# EAGLE schematic mdbt40 (EAGLE 6.6.0)
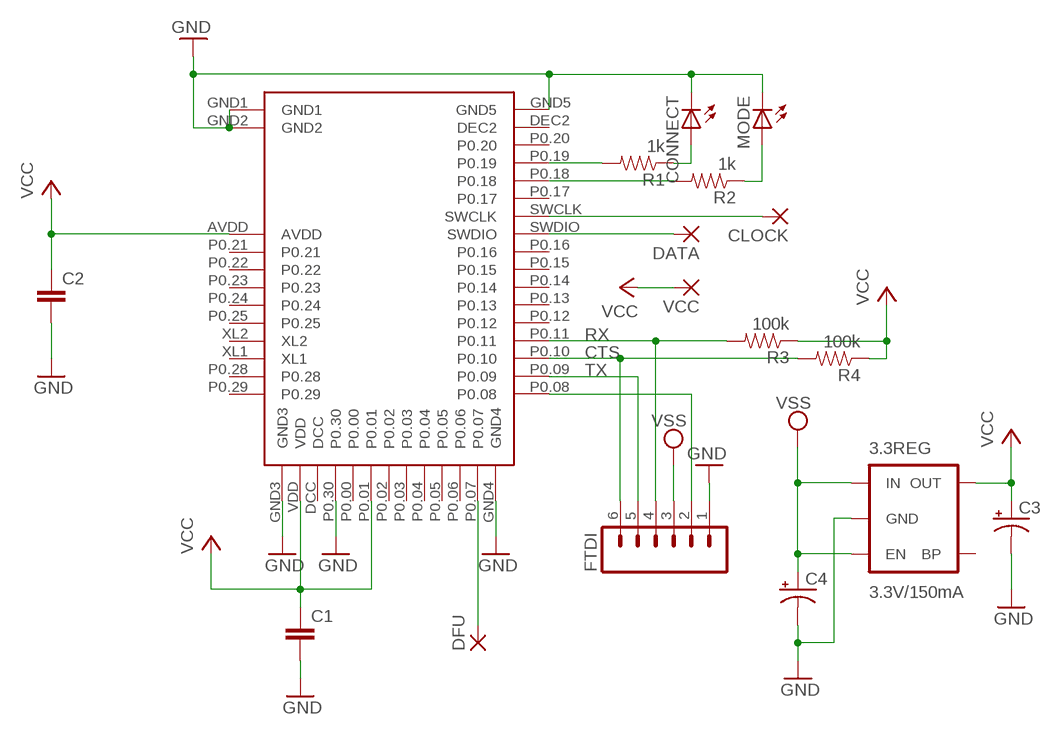
[diagram p0: schematic, sheet 1]

## Parts
3.3REG  3.3V/150mA  V_REG_MIC52053.3V  [SOT23-5]
C1  CAP0603-CAP  [0603-CAP]
C2  CAP0603-CAP  [0603-CAP]
C3  CAP_POL1206  [EIA3216]
C4  CAP_POL1206  [EIA3216]
CLOCK  SMD2  [SMD1,27-2,54]
CONNECT  LEDCHIPLED_0603  [CHIPLED_0603]
DATA  SMD2  [SMD1,27-2,54]
DFU  SMD2  [SMD1,27-2,54]
FTDI  M06LONGPADS  [1X06_LONGPADS]
MODE  LEDCHIPLED_0603  [CHIPLED_0603]
R1  1k  RESISTOR0603  [0603-RES]
R2  1k  RESISTOR0603  [0603-RES]
R3  100k  RESISTOR0603  [0603-RES]
R4  100k  RESISTOR0603  [0603-RES]
U$1  MDBT40  [MDBT40]
VCC  SMD2  [SMD1,27-2,54]

## Nets
CTS: FTDI.6 R4.2 U$1.P0.10
GND: 3.3REG.2(GND) C1.2 C2.2 C3.C(-) C4.C(-) CONNECT.C FTDI.1 MODE.C U$1.GND1 U$1.GND2 U$1.GND3 U$1.GND4 U$1.GND5 U$1.P0.30
N$1: R1.2 U$1.P0.19
N$2: R2.2 U$1.P0.18
N$3: CONNECT.A R1.1
N$4: MODE.A R2.1
N$5: CLOCK.1(P) U$1.SWCLK
N$6: DATA.1(P) U$1.SWDIO
N$7: DFU.1(P) U$1.P0.07
N$8: FTDI.2 U$1.P0.08
RX: FTDI.4 R3.2 U$1.P0.11
TX: FTDI.5 U$1.P0.09
VCC: 3.3REG.5(OUT) C1.1 C2.1 C3.A(+) R3.1 R4.1 U$1.AVDD U$1.P0.01 U$1.VDD VCC.1(P)
VSS: 3.3REG.1(IN) 3.3REG.3(EN) C4.A(+) FTDI.3
Unconnected: 3.3REG.4(BP) U$1.DCC U$1.DEC2 U$1.P0.00 U$1.P0.02 U$1.P0.03 U$1.P0.04 U$1.P0.05 U$1.P0.06 U$1.P0.12 U$1.P0.13 U$1.P0.14 U$1.P0.15 U$1.P0.16 U$1.P0.17 U$1.P0.20 U$1.P0.21 U$1.P0.22 U$1.P0.23 U$1.P0.24 U$1.P0.25 U$1.P0.28 U$1.P0.29 U$1.XL1 U$1.XL2

## Library data of the parts
3.3REG = SparkFun-PowerIC:V_REG_MIC5205: V_REG MIC5219 Standard 3.3V and 5V 150mA LDO voltage regulator in SOT-23 layout. Micrel part MIC5205. BP (by-pass) pin is used to lower output noise with 470pF cap, may be left open.; PROD_ID: VREG-00822
C1 C2 = SparkFun-Passives:CAP: Capacitor Standard 0603 ceramic capacitor, and 0.1" leaded capacitor.
C3 C4 = SparkFun-Capacitors:CAP_POL: Capacitor Polarized These are standard SMD and PTH capacitors. Normally 10uF, 47uF, and 100uF in electrolytic and tantalum varieties. Always verify the external diameter of the through hole cap, it varies with capacity, voltage, and manufacturer. The EIA devices should be standard.
CLOCK DATA DFU VCC = wirepad:SMD2: SMD PAD
CONNECT MODE = adafruit:LED: LED OSRAM: - CHIPLED LG R971, LG N971, LY N971, LG Q971, LY Q971, LO R971, LY R971 LH N974, LH R974 LS Q976, LO Q976, LY Q976 LO Q996 - Hyper CHIPLED LW Q18S LB Q993, LB Q99A, LB R99A - SideLED LS A670, LO A670, LY A670, LG A670, LP A670 LB A673, LV A673, LT A673, LW A673 LH A674 LY A675 LS A676, LA A676, LO A676, LY A676, LW A676 LS A679, LY A679, LG A679 - Hyper Micro SIDELED® LS Y876, LA Y876, LO Y876, LY Y876 LT Y87S - SmartLED LW L88C, LW L88S LB L89C, LB L89S, LG L890 LS L89K, LO L89K, LY L89K LS L896, LA L896, LO L896, LY L896 - TOPLED LS T670, LO T670, LY T670, LG T670, LP T670 LSG T670, LSP T670, LSY T670, LOP T670, LYG T670 LG T671, LOG T671, LSG T671 LB T673, LV T673, LT T673, LW T673 LH T674 LS T676, LA T676, LO T676, LY T676, LB T676, LH T676, LSB T676, LW T676 LB T67C, LV T67C, LT T67C, LS T67K, LO T67K, LY T67K, LW E67C LS E67B, LA E67B, LO E67B, LY E67B, LB E67C, LV E67C, LT E67C LW T67C LS T679, LY T679, LG T679 LS T770, LO T770, LY T770, LG T770, LP T770 LB T773, LV T773, LT T773, LW T773 LH T774 LS E675, LA E675, LY E675, LS T675 LS T776, LA T776, LO T776, LY T776, LB T776 LHGB T686 LT T68C, LB T68C - Hyper Mini TOPLED® LB M676 - Mini TOPLED Santana® LG M470 LS M47K, LO M47K, LY M47K Source: http://www.osram.convergy.de/
FTDI = SparkFun-Connectors:M06: Header 6 Standard 6-pin 0.1" header. Use with straight break away headers (SKU : PRT-00116), right angle break away headers (PRT-00553), swiss pins (PRT-00743), machine pins (PRT-00117), and female headers (PRT-00115). Molex polarized connector foot print use with SKU : PRT-08094 with associated crimp pins and housings. NOTES ON THE VARIANTS LOCK and LOCK_LONGPADS... This footprint was designed to help hold the alignment of a through-hole component (i.e. 6-pin header) while soldering it into place. You may notice that each hole has been shifted either up or down by 0.005 of an inch from it's more standard position (which is a perfectly straight line). This slight alteration caused the pins (the squares in the middle) to touch the edges of the holes. Because they are alternating, it causes a "brace" to hold the component in place. 0.005 has proven to be the perfect amount of "off-center" position when using our standard breakaway headers. Although looks a little odd when you look at the bare footprint, once you have a header in there, the alteration is very hard to notice. Also,if you push a header all the way into place, it is covered up entirely on the bottom side. This idea of altering the position of holes to aid alignment will be further integrated into the Sparkfun Library for other footprints. It can help hold any component with 3 or more connection pins.
R1-R4 = SparkFun-Resistors:RESISTOR: Resistor Basic schematic elements and footprints for 0603, 1206, and PTH resistors.
U$1 = ITP_Lab:MDBT40